# Altium schematic sheet MICROSD CARD.SchDoc
size A4; SheetNumber: 4; SheetTotal: 11
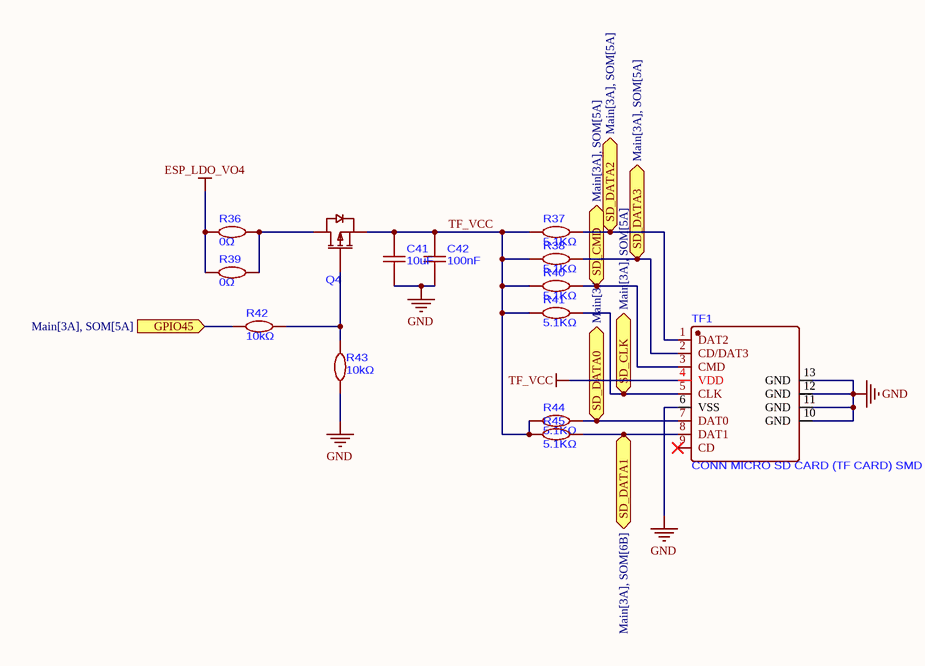
[diagram p0: MICROSD CARD.SchDoc]

## Parts
C41  10uF  [C0603]
C42  100nF  [C0603]
Q4  MOSFET P-CH 30V 4.3A SOT-23  [SOT-23-3_L2.9-W1.6-P1.90-LS2.8-BR]  (value not drawn)
R36  0Ω  [R0603]
R37  5.1KΩ  [R0603]
R38  5.1KΩ  [R0603]
R39  0Ω  [R0603]
R40  5.1KΩ  [R0603]
R41  5.1KΩ  [R0603]
R42  10kΩ  [R0603]
R43  10kΩ  [R0603]
R44  5.1KΩ  [R0603]
R45  5.1KΩ  [R0603]
TF1  CONN MICRO SD CARD (TF CARD) SMD  [TF-SMD_SH_SH-TF-01A]

## Ports
GPIO45 (in, see Main[3A], SOM[5A]), SD_CLK (bidir, see Main[3A], SOM[5A]), SD_CMD (bidir, see Main[3A], SOM[5A]), SD_DATA0 (bidir, see Main[3A], SOM[6B]), SD_DATA1 (bidir, see Main[3A], SOM[6B]), SD_DATA2 (bidir, see Main[3A], SOM[5A]), SD_DATA3 (bidir, see Main[3A], SOM[5A])

## Nets
ESP_LDO_VO4: R36.1 R39.1
GND: C41.1 C42.1 R43.1 TF1.6(VSS) TF1.10(GND) TF1.11(GND) TF1.12(GND) TF1.13(GND)
TF_VCC: C41.2 C42.2 Q4.2(S) R37.1 R38.1 R40.1 R41.1 R44.1 R45.1 TF1.4(VDD)
GPIO45: R42.2 ; port GPIO45
SD_CLK: R41.2 TF1.5(CLK) ; port SD_CLK
SD_CMD: R40.2 TF1.3(CMD) ; port SD_CMD
SD_DATA0: R44.2 TF1.7(DAT0) ; port SD_DATA0
SD_DATA1: R45.2 TF1.8(DAT1) ; port SD_DATA1
SD_DATA2: R37.2 TF1.1(DAT2) ; port SD_DATA2
SD_DATA3: R38.2 TF1.2(CD/DAT3) ; port SD_DATA3
NetQ4_1: Q4.1(G) R42.1 R43.2
NetQ4_3: Q4.3(D) R36.2 R39.2

Not connected (* = marked no-connect by the designer): TF1 9(CD)*

## Library data of the parts
C41 = CL10A106MA8NRNC: 25V 10uF X5R ±20% 0603 Ceramic Capacitors ROHS
C42 = CC0603KRX7R9BB104: 50V 100nF X7R ±10% 0603 Ceramic Capacitors ROHS
Q4 = AO3407A: 30V 4.3A 48mΩ@10V 2.5V@250uA 1 P-Channel SOT-23 Single FETs, MOSFETs ROHS
R36 R39 = RC0603JR-070RL: 100mW 0Ω 75V Thick Film Resistor ±5% 0603 Chip Resistor - Surface Mount RoHS
R37 R38 R40 R41 R44 R45 = FRC0603F5101TS: 100mW 5.1kΩ 75V ±100ppm/℃ Thick Film Resistor ±1% 0603 Chip Resistor - Surface Mount RoHS
R42 R43 = RC0603FR-0710KL: 100mW 10kΩ 75V ±100ppm/℃ Thick Film Resistor ±1% 0603 Chip Resistor - Surface Mount ROHS
TF1 = SH-TF-01A: -25℃~+85℃ Push-Push 2mm Connector and Ejector MicroSD Card (TF Card) SMD PC Card Sockets RoHS